# EAGLE design uav_controller (EAGLE 6.4)
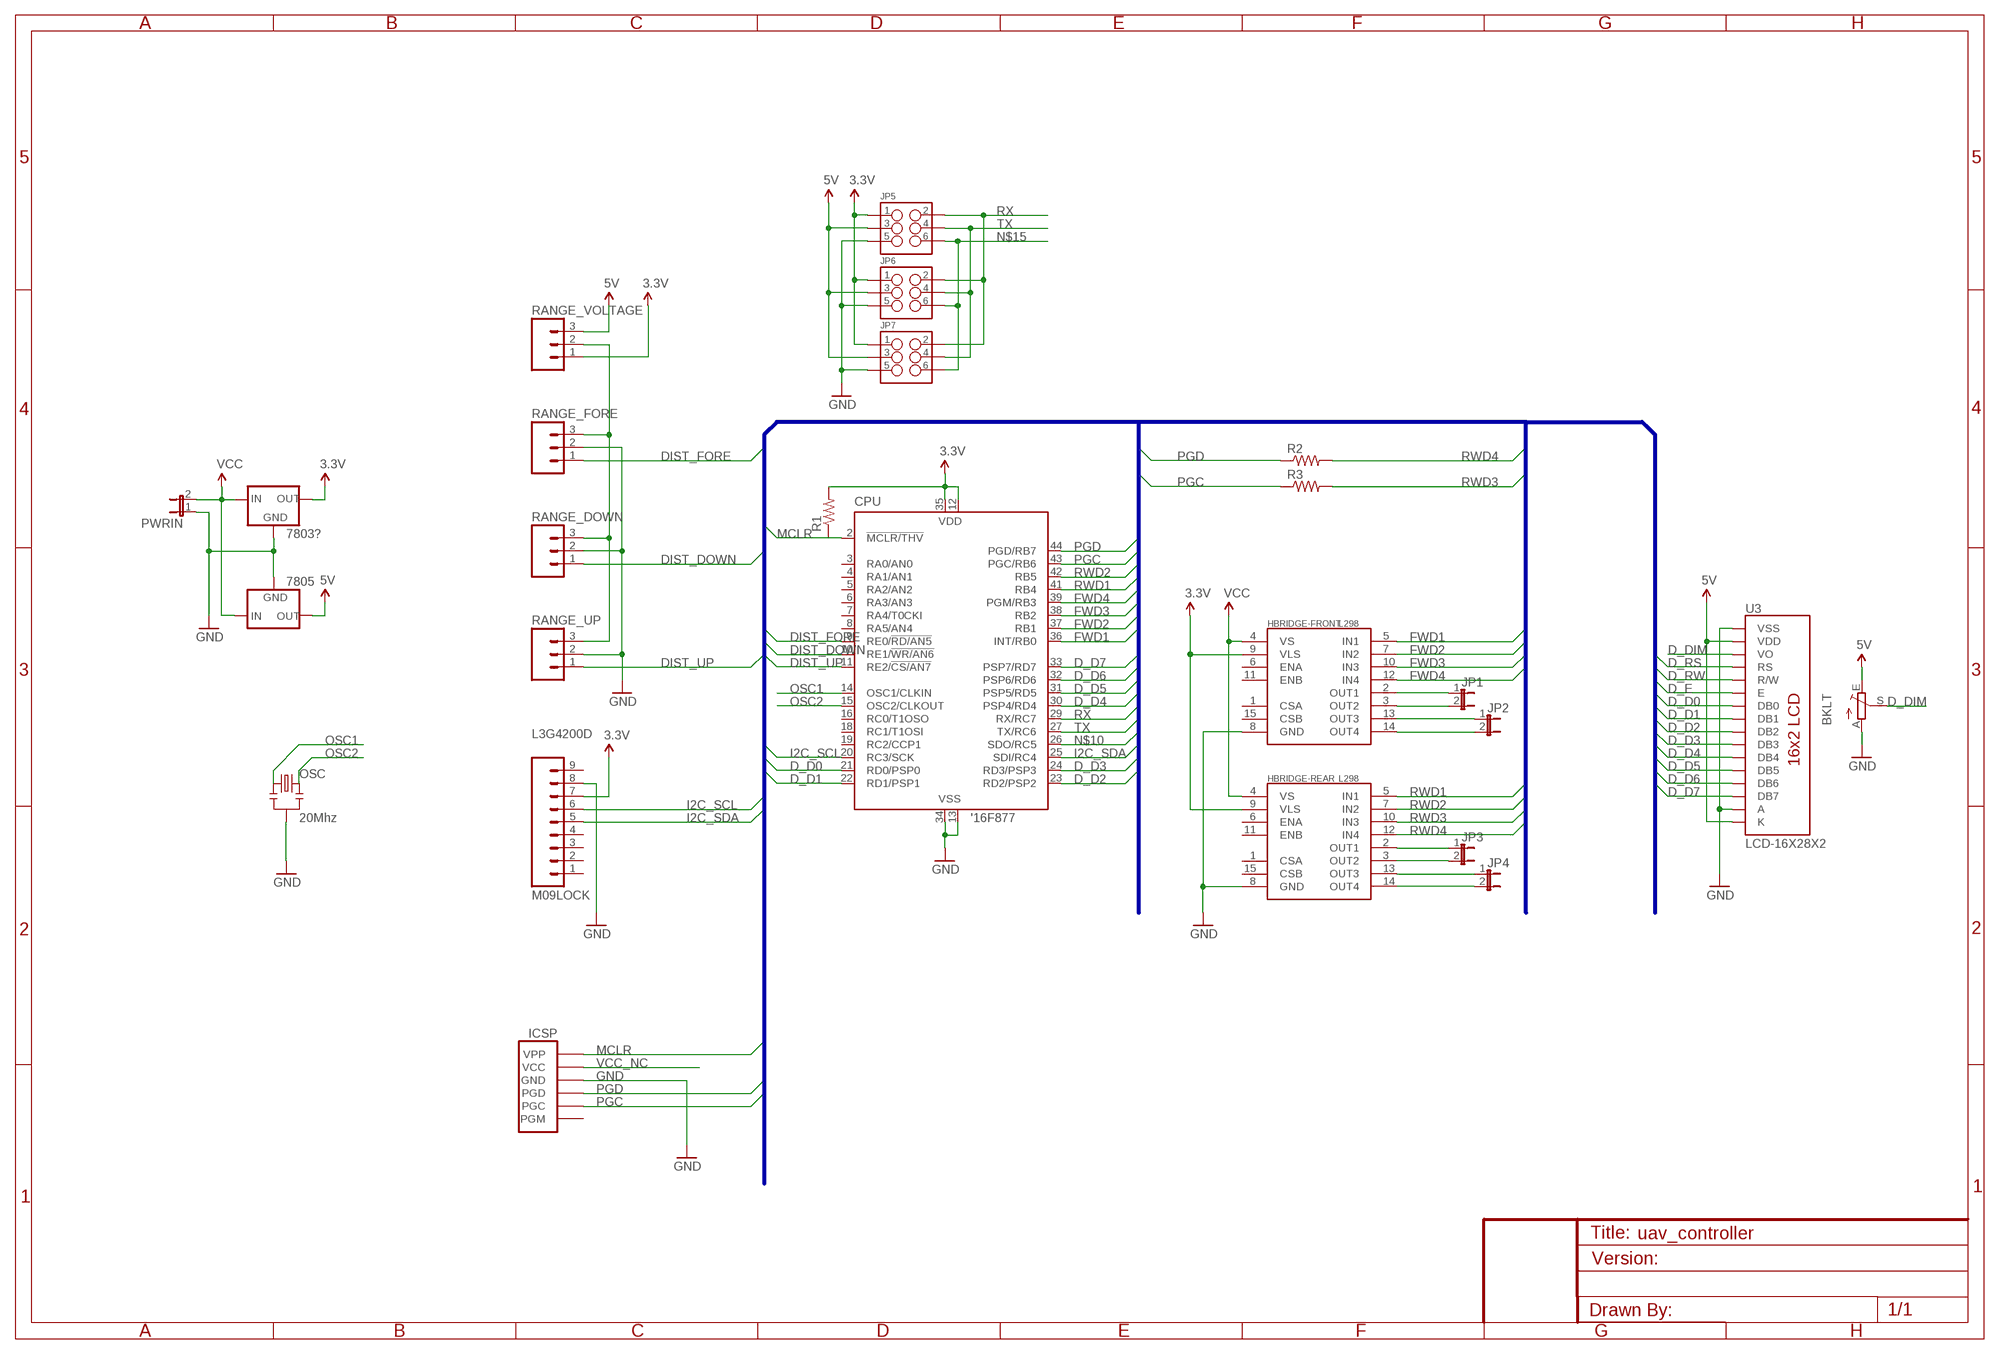
[diagram p0: schematic, sheet 1]

## Parts
7803?  V_REG_78XX-TO-220  [TO-220-ALT]
7805  V_REG_78XX-TO-220  [TO-220-ALT]
BKLT  TRIM_EU-PT10  [PT-10]
CPU  '16F877  PIC16F877SO  [S44]
HBRIDGE-FRONT  L298  [MULTIWATT15]
HBRIDGE-REAR  L298  [MULTIWATT15]
ICSP  PIC-ICSPPOLAR_LOCK  [MOLEX-1X6_LOCK]
JP1  JUMPER-2PTH  [1X02]
JP2  JUMPER-2PTH  [1X02]
JP3  JUMPER-2PTH  [1X02]
JP4  JUMPER-2PTH  [1X02]
JP5  M03X2  [2X3-SHROUDED]
JP6  M03X2  [2X3-SHROUDED]
JP7  M03X2  [2X3-SHROUDED]
L3G4200D  M09LOCK  [1X09_LOCK]
OSC  20Mhz  RESONATORPTH  [RESONATOR-PTH]
PWRIN  JUMPER-2PTH  [1X02]
R1  RESISTOREZ  [AXIAL-0.3EZ]
R2  RESISTORKIT  [AXIAL-0.3-KIT]
R3  RESISTORKIT  [AXIAL-0.3-KIT]
RANGE_DOWN  M03JST-PTH  [JST-3-PTH]
RANGE_FORE  M03JST-PTH  [JST-3-PTH]
RANGE_UP  M03JST-PTH  [JST-3-PTH]
RANGE_VOLTAGE  M03PTH  [1X03]
U3  LCD-16X28X2  [LCD-8X2]

## Nets
3.3V: 7803?.OUT CPU.12(VDD) CPU.35(VDD) HBRIDGE-FRONT.9(VLS) HBRIDGE-REAR.9(VLS) JP5.1 JP6.1 JP7.1 L3G4200D.7 R1.P$2 RANGE_VOLTAGE.1
5V: 7805.OUT BKLT.E JP5.3 JP6.3 JP7.3 RANGE_VOLTAGE.3 U3.2(VDD) U3.16(K)
D_D0: CPU.21(RD0/PSP0) U3.7(DB0)
D_D1: CPU.22(RD1/PSP1) U3.8(DB1)
D_D2: CPU.23(RD2/PSP2) U3.9(DB2)
D_D3: CPU.24(RD3/PSP3) U3.10(DB3)
D_D4: CPU.30(PSP4/RD4) U3.11(DB4)
D_D5: CPU.31(PSP5/RD5) U3.12(DB5)
D_D6: CPU.32(PSP6/RD6) U3.13(DB6)
D_D7: CPU.33(PSP7/RD7) U3.14(DB7)
D_DIM: BKLT.S U3.3(VO)
D_E: U3.6(E)
D_RS: U3.4(RS)
D_RW: U3.5(R/W)
DIST_DOWN: CPU.10(RE1/!WR/AN6) RANGE_DOWN.1
DIST_FORE: CPU.9(RE0/!RD/AN5) RANGE_FORE.1
DIST_UP: CPU.11(RE2/!CS/AN7) RANGE_UP.1
FWD1: CPU.36(INT/RB0) HBRIDGE-FRONT.5(IN1)
FWD2: CPU.37(RB1) HBRIDGE-FRONT.7(IN2)
FWD3: CPU.38(RB2) HBRIDGE-FRONT.10(IN3)
FWD4: CPU.39(PGM/RB3) HBRIDGE-FRONT.12(IN4)
GND: 7803?.GND 7805.GND BKLT.A CPU.13(VSS) CPU.34(VSS) HBRIDGE-FRONT.8(GND) HBRIDGE-REAR.8(GND) ICSP.4(GND) JP5.5 JP6.5 JP7.5 L3G4200D.8 OSC.2 PWRIN.1 RANGE_DOWN.2 RANGE_FORE.2 RANGE_UP.2 U3.1(VSS) U3.15(A)
I2C_SCL: CPU.20(RC3/SCK) L3G4200D.6
I2C_SDA: CPU.25(SDI/RC4) L3G4200D.5
MCLR: CPU.2(!MCLR/THV) ICSP.6(VPP) R1.P$1
N$2: HBRIDGE-FRONT.14(OUT4) JP2.2
N$3: HBRIDGE-FRONT.13(OUT3) JP2.1
N$4: HBRIDGE-FRONT.3(OUT2) JP1.2
N$5: HBRIDGE-FRONT.2(OUT1) JP1.1
N$6: HBRIDGE-REAR.2(OUT1) JP3.1
N$7: HBRIDGE-REAR.3(OUT2) JP3.2
N$8: HBRIDGE-REAR.13(OUT3) JP4.1
N$9: HBRIDGE-REAR.14(OUT4) JP4.2
N$10: CPU.26(SDO/RC5)
N$15: JP5.6 JP6.6 JP7.6
N$17: RANGE_DOWN.3 RANGE_FORE.3 RANGE_UP.3 RANGE_VOLTAGE.2
OSC1: CPU.14(OSC1/CLKIN) OSC.1
OSC2: CPU.15(OSC2/CLKOUT) OSC.3
PGC: CPU.43(PGC/RB6) ICSP.2(PGC) R3.P$1
PGD: CPU.44(PGD/RB7) ICSP.3(PGD) R2.P$1
RWD1: CPU.41(RB4) HBRIDGE-REAR.5(IN1)
RWD2: CPU.42(RB5) HBRIDGE-REAR.7(IN2)
RWD3: HBRIDGE-REAR.10(IN3) R3.P$2
RWD4: HBRIDGE-REAR.12(IN4) R2.P$2
RX: CPU.29(RX/RC7) JP5.2 JP6.2 JP7.2
TX: CPU.27(TX/RC6) JP5.4 JP6.4 JP7.4
VCC: 7803?.IN 7805.IN HBRIDGE-FRONT.4(VS) HBRIDGE-REAR.4(VS) PWRIN.2
VCC_NC: ICSP.5(VCC)
Unconnected: CPU.3(RA0/AN0) CPU.4(RA1/AN1) CPU.5(RA2/AN2) CPU.6(RA3/AN3) CPU.7(RA4/T0CKI) CPU.8(RA5/AN4) CPU.16(RC0/T1OSO) CPU.18(RC1/T1OSI) CPU.19(RC2/CCP1) HBRIDGE-FRONT.1(CSA) HBRIDGE-FRONT.6(ENA) HBRIDGE-FRONT.11(ENB) HBRIDGE-FRONT.15(CSB) HBRIDGE-REAR.1(CSA) HBRIDGE-REAR.6(ENA) HBRIDGE-REAR.11(ENB) HBRIDGE-REAR.15(CSB) ICSP.1(PGM) L3G4200D.1 L3G4200D.2 L3G4200D.3 L3G4200D.4 L3G4200D.9

## Buses
B$1

## Library data of the parts
7803? 7805 = SparkFun-PowerIC:V_REG_78XX: Voltage Regulator Standard 7805 5V regulator. IGO (Input Ground Output). Spark Fun Electronics SKU : COM-00107
BKLT = pot:TRIM_EU-: POTENTIOMETER
CPU = microchip:PIC16F87*: MICROCONTROLLER; OC_FARNELL: unknown; OC_NEWARK: unknown
HBRIDGE-FRONT HBRIDGE-REAR = SparkFun-PowerIC:L298: L298 Dual Full Bridge Driver
ICSP = SparkFun-Connectors:PIC-ICSP: ISCP Programming connector for UAV, UBW Kit, etc.
JP1-JP4 PWRIN = SparkFun-Passives:JUMPER-2: Jumper Basic 0.1" spaced jumper. Use with breakaway headers.
JP5-JP7 = SparkFun-Connectors:M03X2: 2x3 .1" header. Shrouded, with keying- CONN-10681 SMT- CONN-11415 Pogo pins- HW-11044; PROD_ID: CONN-10681
L3G4200D = SparkFun-Connectors:M09: Header 9 Standard 9-pin 0.1" header. Use with straight break away headers (SKU : PRT-00116), right angle break away headers (PRT-00553), swiss pins (PRT-00743), machine pins (PRT-00117), and female headers (PRT-00115).
OSC = SparkFun-FreqCtrl:RESONATOR: Resonator Small SMD resonator. Used, eg, on the Arduino Pro/ Pro Mini boards. 8MHz- XTAL-08895 16MHz- XTAL-08900
R1-R3 = SparkFun-Resistors:RESISTOR: Resistor Basic schematic elements and footprints for 0603, 1206, and PTH resistors.
RANGE_DOWN RANGE_FORE RANGE_UP RANGE_VOLTAGE = SparkFun-Connectors:M03: Header 3 Standard 3-pin 0.1" header. Use with straight break away headers (SKU : PRT-00116), right angle break away headers (PRT-00553), swiss pins (PRT-00743), machine pins (PRT-00117), and female headers (PRT-00115). Molex polarized connector foot print use with SKU : PRT-08232 with associated crimp pins and housings.
U3 = SparkFun-Displays:LCD-16X2: Standard text-only 16x2 parallel input LCD

## Board
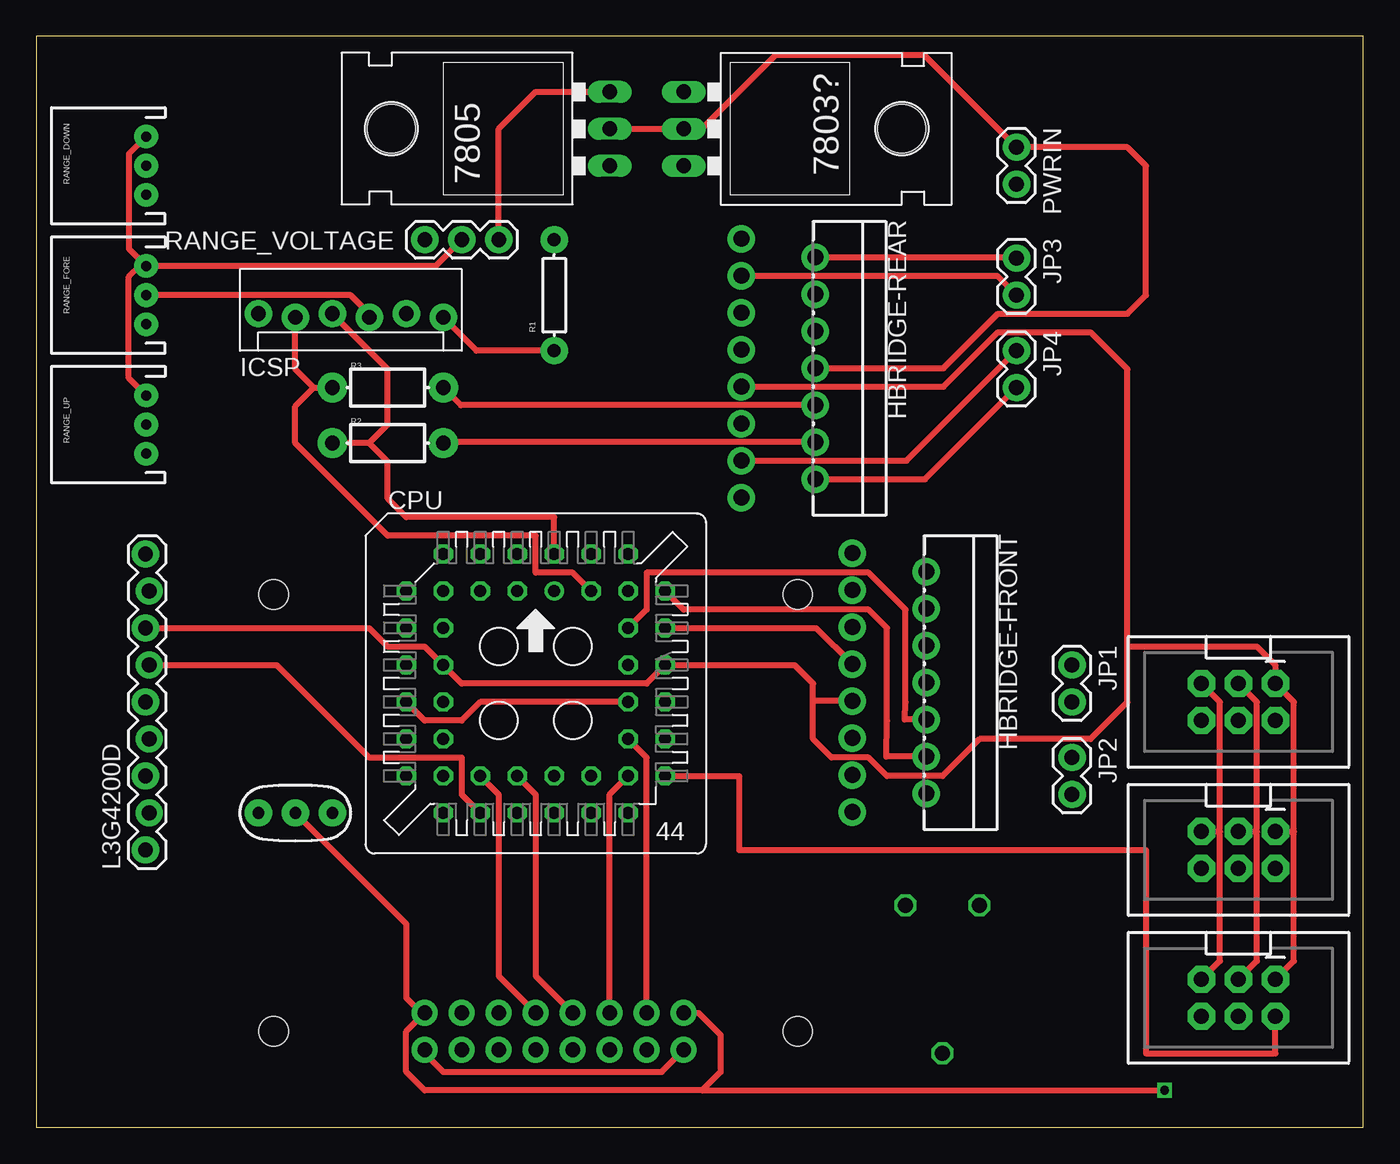
[diagram p1: board, top side]
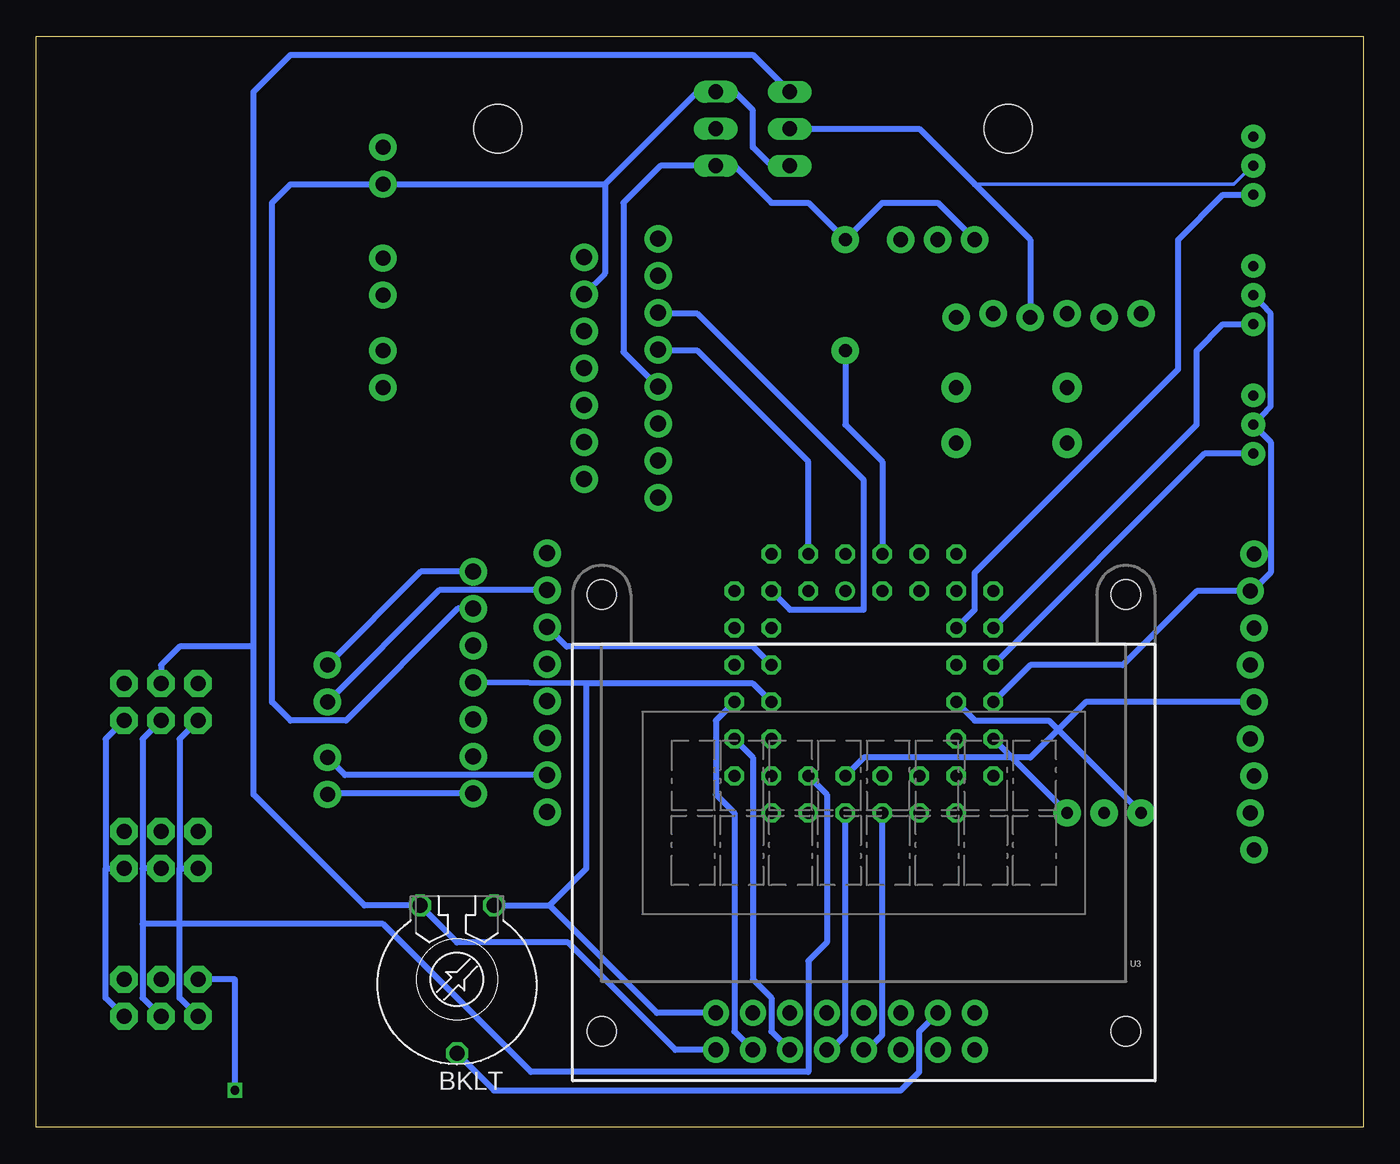
[diagram p2: board, bottom side, seen from below]

Size 91.11 x 74.92 mm. Coordinates in mm from the lower left corner, seen from the top.
Outline: 0,0 91.11,0 91.11,74.92 0,74.92 0,0
Copper layers (1*16): Top 0.035mm / dielectric 1.5mm / Bottom 0.035mm
Design rules "default": minimum track width 10mil, minimum drill 24mil, track to track 8mil, track to pad 8mil, pad to pad 8mil, via to via 8mil, smd to smd 8mil, copper to edge 40mil, drill to drill 8mil, minimum pad ring 10mil, minimum via ring 8mil, stop-mask expansion 4mil, vias tented up to drill 0mil, thermal gap 10mil

### Footprints (pad centres in the part's own frame; a part is rotated, then mirrored left to right if it is on the bottom)
TO-220-ALT = drill 1.016 long: GND 0,-3.81; IN -2.54,-3.81; OUT 2.54,-3.81 | hole 3.302: 0,11.176
PT-10 = drill 1.016 octagon: A -2.54,-5.08; E 2.54,-5.08; S 0,5.08
S44 = drill 0.813: 1 1.27,6.35 | drill 0.813 octagon: 2 -1.27,8.89; 3 -1.27,6.35; 4 -3.81,8.89; 5 -3.81,6.35; 6 -6.35,8.89; 7 -8.89,6.35; 8 -6.35,6.35; 9 -8.89,3.81; 10 -6.35,3.81; 11 -8.89,1.27; 12 -6.35,1.27; 13 -8.89,-1.27; 14 -6.35,-1.27; 15 -8.89,-3.81; 16 -6.35,-3.81; 17 -8.89,-6.35; 18 -6.35,-8.89; 19 -6.35,-6.35; 20 -3.81,-8.89; 21 -3.81,-6.35; 22 -1.27,-8.89; 23 -1.27,-6.35; 24 1.27,-8.89; 25 1.27,-6.35; 26 3.81,-8.89; 27 3.81,-6.35; 28 6.35,-8.89; 29 8.89,-6.35; 30 6.35,-6.35; 31 8.89,-3.81; 32 6.35,-3.81; 33 8.89,-1.27; 34 6.35,-1.27; 35 8.89,1.27; 36 6.35,1.27; 37 8.89,3.81; 38 6.35,3.81; 39 8.89,6.35; 40 6.35,8.89; 41 6.35,6.35; 42 3.81,8.89; 43 3.81,6.35; 44 1.27,8.89
MULTIWATT15 = drill 1.1 pad 1.9: 1 -8.95,-2.39; 2 -7.68,2.69; 3 -6.41,-2.39; 4 -5.14,2.69; 5 -3.87,-2.39; 6 -2.6,2.69; 7 -1.33,-2.39; 8 -0.06,2.69; 9 1.21,-2.39; 10 2.48,2.69; 11 3.75,-2.39; 12 5.02,2.69; 13 6.29,-2.39; 14 7.56,2.69; 15 8.83,-2.39
MOLEX-1X6_LOCK = drill 1.016 pad 1.88: 1 0,0; 2 2.54,-0.254; 3 5.08,0; 4 7.62,-0.254; 5 10.16,0; 6 12.7,-0.254
1X02 = drill 1.016 pad 1.88: 1 0,0; 2 2.54,0
2X3-SHROUDED = drill 1.016 pad 1.88 octagon: 1 -1.27,2.54; 2 1.27,2.54; 3 -1.27,0; 4 1.27,0; 5 -1.27,-2.54; 6 1.27,-2.54
1X09_LOCK = drill 1.016 pad 1.88: 1 0,0.127; 2 2.54,-0.127; 3 5.08,0.127; 4 7.62,-0.127; 5 10.16,0.127; 6 12.7,-0.127; 7 15.24,0.127; 8 17.78,-0.127; 9 20.32,0.127
RESONATOR-PTH = drill 0.8 pad 1.88: 1 -2.54,0; 2 0,0; 3 2.54,0
AXIAL-0.3EZ = drill 0.9 pad 1.88: P$1 -3.81,0; P$2 3.81,0
AXIAL-0.3-KIT = drill 1.016 pad 2.032: P$1 -3.81,0; P$2 3.81,0
JST-3-PTH = drill 0.7 pad 1.626: 1 -2,-5; 2 0,-5; 3 2,-5
1X03 = drill 1.016 pad 1.88: 1 0,0; 2 2.54,0; 3 5.08,0
LCD-8X2 = drill 1 pad 1.778: 1 -7.62,13.73; 2 -7.62,16.27; 3 -5.08,13.73; 4 -5.08,16.27; 5 -2.54,13.73; 6 -2.54,16.27; 7 0,13.73; 8 0,16.27; 9 2.54,13.73; 10 2.54,16.27; 11 5.08,13.73; 12 5.08,16.27; 13 7.62,13.73; 14 7.62,16.27; 15 10.16,13.73; 16 10.16,16.27 | hole 2: 18,15; -18,15; -18,-15; 18,-15

### Placement (x,y rotation side)
7803?  48.26,68.58 270 top
7805  35.56,68.58 90 top
BKLT  62.23,10.16 180 bottom
CPU  34.29,30.48 0 top
HBRIDGE-FRONT  58.42,30.48 270 top
HBRIDGE-REAR  50.8,52.07 270 top
ICSP  15.24,55.88 0 top
JP1  71.12,31.75 270 top
JP2  71.12,25.4 270 top
JP3  67.31,59.69 270 top
JP4  67.31,53.34 270 top
JP5  82.55,19.05 270 top
JP6  82.55,29.21 270 top
JP7  82.55,8.89 270 top
L3G4200D  7.62,19.05 90 top
OSC  17.78,21.59 0 top
PWRIN  67.31,67.31 270 top
R1  35.56,57.15 90 top
R2  24.13,46.99 0 top
R3  24.13,50.8 0 top
RANGE_DOWN  2.54,66.04 90 top
RANGE_FORE  2.54,57.15 90 top
RANGE_UP  2.54,48.26 90 top
RANGE_VOLTAGE  26.67,60.96 0 top
U3  34.29,21.59 180 bottom

### Tracks (layer width: path | path; a pad name or v marks a point on that pad's centre or on a via)
3.3V
  Top 0.406: HBRIDGE-REAR.9 62.29,50.86 66.04,54.61 72.39,54.61 74.93,52.07 74.93,33.02 | 53.34,29.21 53.34,26.67 54.61,25.4 57.15,25.4 58.42,24.13 62.23,24.13 64.77,26.67 72.39,26.67 74.93,29.21 74.93,33.02 | 53.34,29.21 53.34,30.48 52.07,31.75 CPU.35 41.91,30.48 29.21,30.48 CPU.12 26.67,33.02 24.13,33.02 22.86,34.29 L3G4200D.7 | HBRIDGE-FRONT.9 53.4,29.27 53.34,29.21 | JP7.1 86.36,11.43 86.36,20.32 | JP5.1 86.36,20.32 | 86.36,20.32 86.36,29.21 JP6.1 85.09,31.75 83.82,33.02 74.93,33.02
  Bottom 0.406: HBRIDGE-REAR.9 50.8,53.25 50.8,63.5 48.26,66.04 7803?.OUT 43.18,66.04 40.64,63.5 38.1,63.5 R1.P$2 33.02,63.5 29.21,63.5 RANGE_VOLTAGE.1
5V
  Top 0.406: U3.2 26.67,5.08 27.94,3.81 42.94,3.81 U3.16 | RANGE_VOLTAGE.3 31.75,68.58 34.29,71.12 7805.OUT | JP5.3 83.82,20.32 | 83.82,20.32 83.82,29.21 JP6.3 | JP7.3 83.82,11.43 83.82,20.32
  Bottom 0.406: U3.16 47.23,5.32 54.61,12.7 62.23,12.7 BKLT.E 68.58,15.24 76.2,22.86 76.2,33.02 | 76.2,33.02 76.2,71.12 73.66,73.66 41.91,73.66 7805.OUT | 76.2,33.02 81.28,33.02 82.55,31.75 JP6.3
D_D0
  Top 0.406: CPU.21 31.75,22.86 31.75,10.4 U3.7
D_D1
  Bottom 0.406: U3.8 34.05,5.32 33.02,6.35 CPU.22
D_D2
  Top 0.406: CPU.23 34.29,22.86 34.29,10.4 U3.9
D_D3
  Bottom 0.406: U3.10 36.59,5.32 35.56,6.35 CPU.24
D_D4
  Top 0.406: U3.11 39.37,22.86 CPU.30
D_D5
  Bottom 0.406: CPU.31 41.91,25.4 41.91,10.16 40.64,8.89 40.64,6.59 U3.12
D_D6
  Top 0.406: U3.13 41.91,25.4 CPU.32
D_D7
  Bottom 0.406: CPU.33 44.45,27.94 44.45,22.86 43.18,21.59 43.18,6.59 U3.14
D_DIM
  Bottom 0.406: BKLT.S 59.69,2.54 31.75,2.54 30.48,3.81 30.48,6.59 U3.3
DIST_DOWN
  Bottom 0.406: CPU.10 26.67,35.56 26.67,38.1 12.7,52.07 12.7,60.96 9.62,64.04 RANGE_DOWN.1
DIST_FORE
  Bottom 0.406: CPU.9 11.43,48.26 11.43,53.34 9.62,55.15 RANGE_FORE.1
DIST_UP
  Bottom 0.406: RANGE_UP.1 10.89,46.26 CPU.11
FWD1
  Bottom 0.406: CPU.36 41.91,33.02 54.7,33.02 HBRIDGE-FRONT.5
FWD2
  Top 0.406: CPU.37 53.55,34.29 HBRIDGE-FRONT.7
FWD3
  Top 0.406: HBRIDGE-FRONT.10 59.63,28 59.69,29.21 59.69,35.56 57.15,38.1 41.91,38.1 41.91,35.56 CPU.38
FWD4
  Top 0.406: HBRIDGE-FRONT.12 58.36,25.46 58.42,27.94 58.42,34.29 57.15,35.56 44.45,35.56 CPU.39
GND  (via drill 0.6)
  Top 0.406: CPU.34 30.48,29.21 29.21,27.94 26.67,27.94 CPU.13 | U3.15 45.48,7.86 46.99,6.35 46.99,3.81 45.72,2.54 | 45.72,2.54 26.67,2.54 25.4,3.81 25.4,6.59 U3.1 26.43,7.86 25.4,8.89 25.4,13.97 OSC.2 | 7805.GND 7803?.GND 45.72,68.58 50.8,73.66 60.96,73.66 PWRIN.1 74.93,67.31 76.2,66.04 76.2,57.15 74.93,55.88 66.04,55.88 62.29,52.13 HBRIDGE-REAR.8 | JP7.5 81.28,11.43 81.28,20.32 | JP5.5 81.28,20.32 | 81.28,20.32 81.28,29.21 JP6.5 | 45.72,2.54 v77.47,2.54 | ICSP.4 22.86,55.88 21.59,57.15 RANGE_FORE.2
  Bottom 0.254: 26.67,64.77 8.89,64.77 7.62,66.04 RANGE_DOWN.2
  Bottom 0.406: CPU.34 41.91,30.48 53.34,30.48 | 53.34,30.48 53.43,30.48 HBRIDGE-FRONT.8 | U3.15 48.5,7.86 55.88,15.24 | BKLT.A 55.88,15.24 | 55.88,15.24 53.34,17.78 53.34,30.48 | CPU.13 22.86,31.75 16.51,31.75 11.43,36.83 L3G4200D.8 7.62,36.83 6.35,38.1 6.35,47.07 RANGE_UP.2 6.35,49.53 6.35,55.88 RANGE_FORE.2 | v77.47,2.54 77.47,10.16 JP7.5 | 7805.GND 30.48,68.58 26.67,64.77 22.86,60.96 ICSP.4
I2C_SCL
  Top 0.406: L3G4200D.6 16.51,31.75 22.86,25.4 29.21,25.4 29.21,22.86 CPU.20
I2C_SDA
  Bottom 0.406: L3G4200D.5 19.05,29.21 22.86,25.4 34.29,25.4 CPU.25
MCLR
  Top 0.406: R1.P$1 30.23,53.34 ICSP.6
  Bottom 0.406: R1.P$1 35.56,48.26 33.02,45.72 CPU.2
N$2
  Bottom 0.406: HBRIDGE-FRONT.14 71.06,22.92 JP2.2
N$3
  Bottom 0.406: HBRIDGE-FRONT.13 69.91,24.19 JP2.1
N$4
  Bottom 0.406: HBRIDGE-FRONT.3 63.44,36.89 JP1.2
N$5
  Bottom 0.406: HBRIDGE-FRONT.2 64.71,38.16 JP1.1
N$6
  Top 0.406: HBRIDGE-REAR.2 67.25,59.75 JP3.1
N$7
  Top 0.406: HBRIDGE-REAR.3 65.98,58.48 JP3.2
N$8
  Top 0.406: HBRIDGE-REAR.13 59.75,45.78 JP4.1
N$9
  Top 0.406: HBRIDGE-REAR.14 61.02,44.51 JP4.2
N$15
  Bottom 0.406: JP7.6 81.28,8.89 81.28,17.78 | 81.28,17.78 JP5.6 | JP6.6 81.28,26.67 81.28,17.78
N$17
  Top 0.406: RANGE_UP.3 6.35,51.45 6.35,58.42 7.08,59.15 RANGE_FORE.3 | RANGE_DOWN.3 6.35,66.85 6.35,60.34 RANGE_FORE.3 | RANGE_VOLTAGE.2 27.4,59.15 RANGE_FORE.3
OSC1
  Bottom 0.406: CPU.14 26.67,27.94 21.59,27.94 OSC.1
OSC2
  Bottom 0.406: OSC.3 CPU.15
PGC
  Top 0.406: CPU.43 36.83,38.1 34.29,38.1 34.29,40.64 24.13,40.64 17.78,46.99 17.78,49.53 19.05,50.8 | 19.05,50.8 R3.P$1 | 19.05,50.8 17.78,52.07 ICSP.2
PGD
  Top 0.406: CPU.44 35.56,41.91 25.4,41.91 24.13,43.18 24.13,45.72 22.86,46.99 | 22.86,46.99 24.13,48.26 24.13,52.07 ICSP.3 | 22.86,46.99 R2.P$1
RWD1
  Bottom 0.406: CPU.41 39.37,35.56 34.29,35.56 34.29,44.45 45.72,55.88 48.35,55.88 HBRIDGE-REAR.5
RWD2
  Bottom 0.406: CPU.42 38.1,45.72 45.72,53.34 48.35,53.34 HBRIDGE-REAR.7
RWD3
  Top 0.406: HBRIDGE-REAR.10 29.15,49.59 R3.P$2
RWD4
  Top 0.406: HBRIDGE-REAR.12 28,47.05 R2.P$2
RX
  Top 0.406: CPU.29 48.26,24.13 48.26,19.05 76.2,19.05 76.2,5.08 85.09,5.08 JP7.2
  Bottom 0.406: JP7.2 86.36,8.89 86.36,17.78 | JP6.2 86.36,26.67 86.36,17.78 | 86.36,17.78 JP5.2
TX
  Bottom 0.406: JP6.4 83.82,26.67 83.82,17.78 | 83.82,17.78 83.82,13.97 | 83.82,13.97 83.82,8.89 JP7.4 | JP5.4 83.82,17.78 | CPU.27 36.83,22.86 36.83,12.7 38.1,11.43 38.1,3.81 57.15,3.81 67.31,13.97 83.82,13.97
VCC
  Bottom 0.406: 7805.IN 40.64,66.04 41.91,67.31 41.91,69.85 43.18,71.12 7803?.IN 45.72,71.12 52.07,64.77 | 52.07,64.77 PWRIN.2 73.66,64.77 74.93,63.5 74.93,29.21 73.66,27.94 69.85,27.94 62.17,35.62 HBRIDGE-FRONT.4 | 52.07,64.77 52.07,58.63 HBRIDGE-REAR.4